# Altium schematic sheet Nixies.SchDoc
size B; SheetNumber: 4; SheetTotal: 5
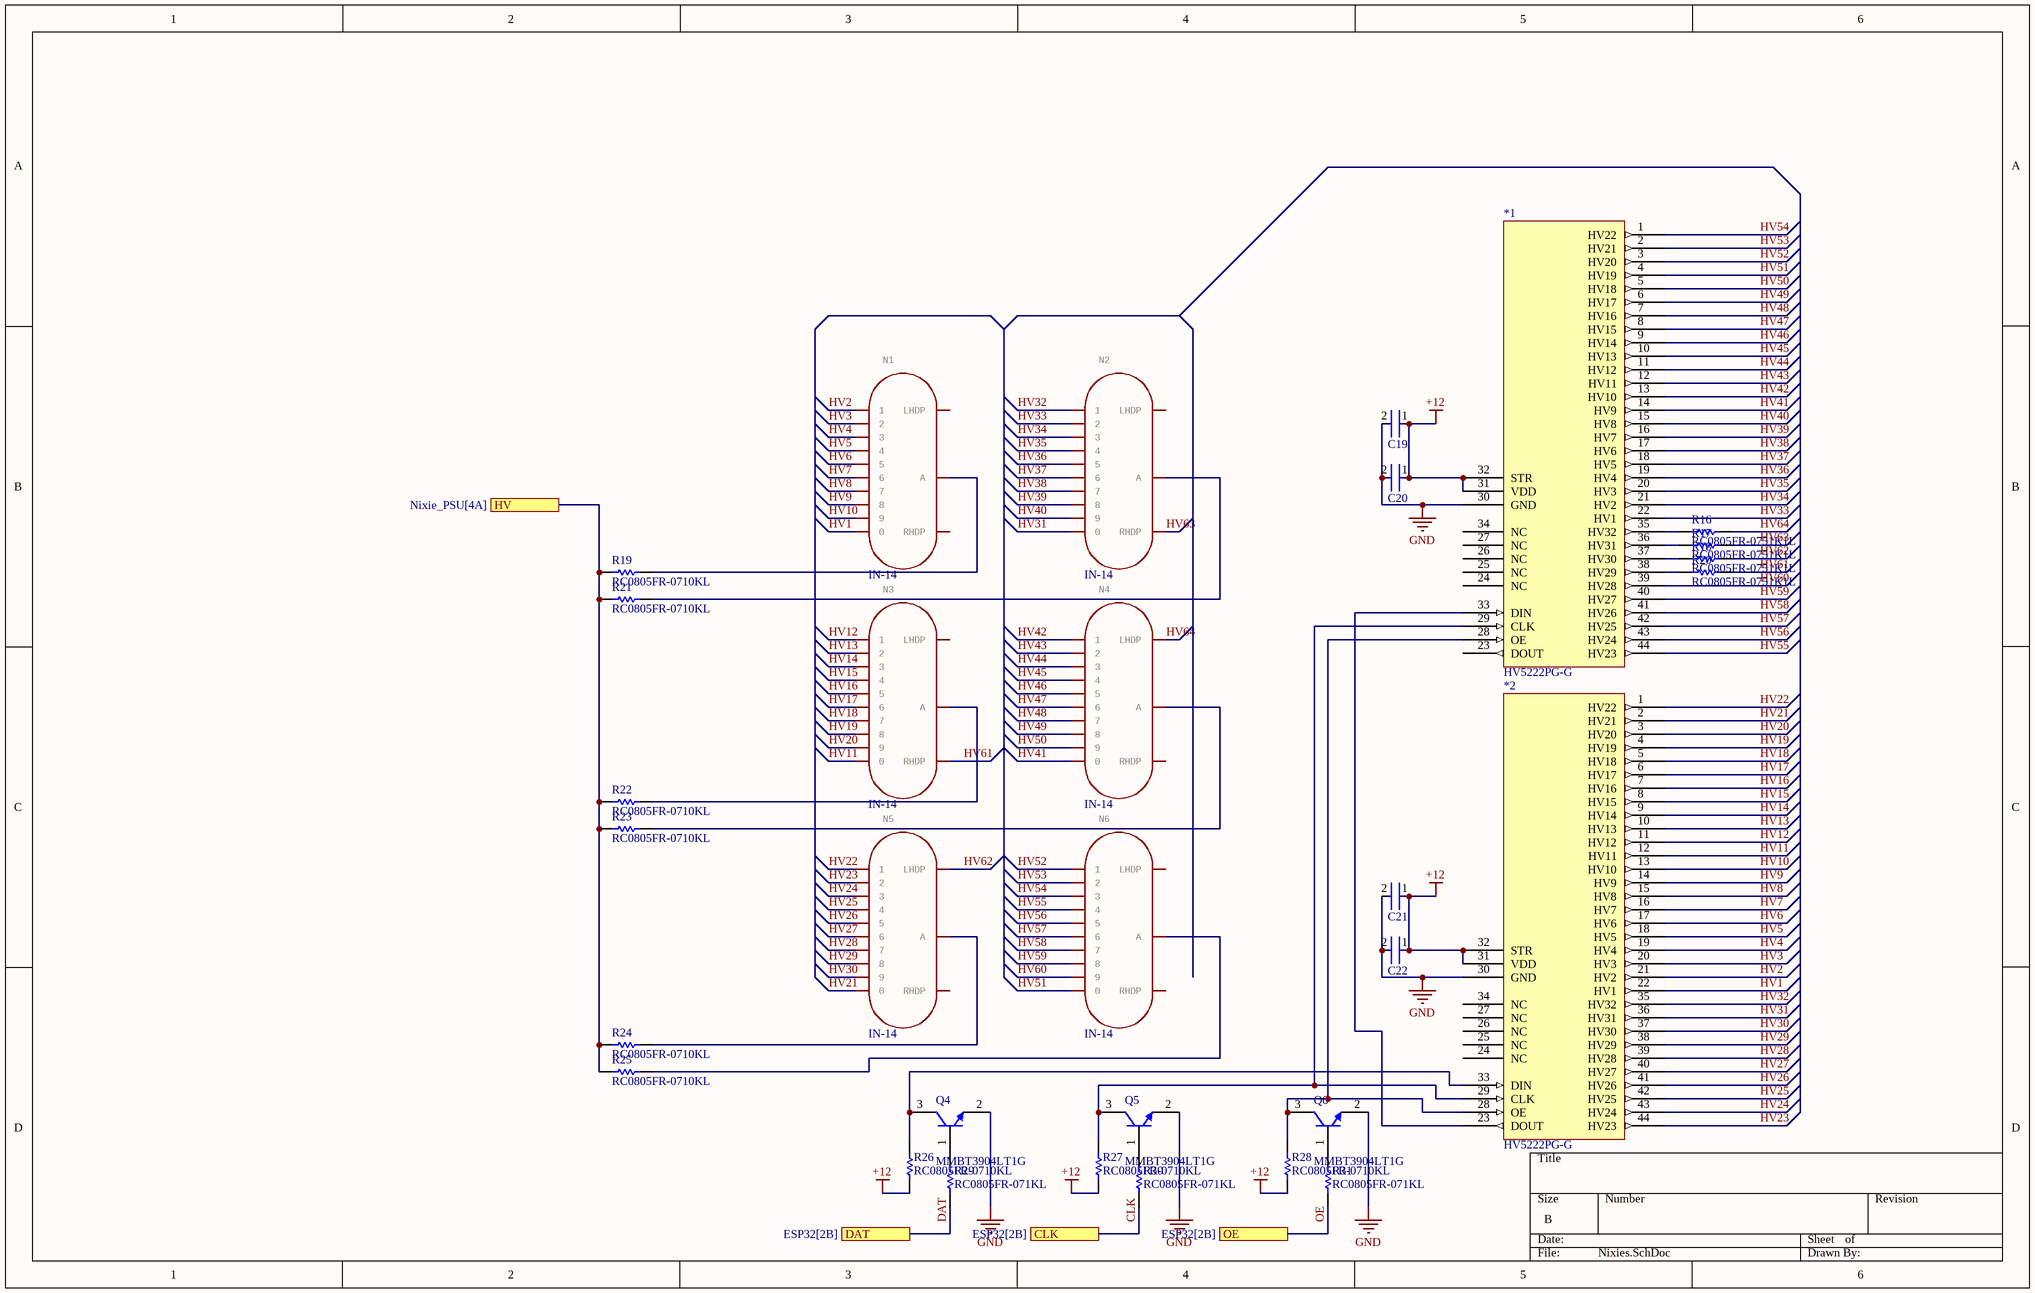
[diagram p0: Nixies.SchDoc]

## Parts
*1  HV5222PG-G  [QFP80P1390X1390X235-44N]
*2  HV5222PG-G  [QFP80P1390X1390X235-44N]
C19  GRM188R60J476ME15D  [FP-GRM188-0_2-IPC_B]  (value not drawn)
C20  GRM188R60J476ME15D  [FP-GRM188-0_2-IPC_B]  (value not drawn)
C21  GRM188R60J476ME15D  [FP-GRM188-0_2-IPC_B]  (value not drawn)
C22  GRM188R60J476ME15D  [FP-GRM188-0_2-IPC_B]  (value not drawn)
N1  IN-14  [IN-14]
N2  IN-14  [IN-14]
N3  IN-14  [IN-14]
N4  IN-14  [IN-14]
N5  IN-14  [IN-14]
N6  IN-14  [IN-14]
Q4  MMBT3904LT1G  [ONSC-SOT-23-3-318-08_V]
Q5  MMBT3904LT1G  [ONSC-SOT-23-3-318-08_V]
Q6  MMBT3904LT1G  [ONSC-SOT-23-3-318-08_V]
R16  RC0805FR-0751K1L  [RESC2013X60X35LL10T20]
R17  RC0805FR-0751K1L  [RESC2013X60X35LL10T20]
R18  RC0805FR-0751K1L  [RESC2013X60X35LL10T20]
R19  RC0805FR-0710KL  [RESC2013X60X35NL10T20]
R20  RC0805FR-0751K1L  [RESC2013X60X35LL10T20]
R21  RC0805FR-0710KL  [RESC2013X60X35NL10T20]
R22  RC0805FR-0710KL  [RESC2013X60X35NL10T20]
R23  RC0805FR-0710KL  [RESC2013X60X35NL10T20]
R24  RC0805FR-0710KL  [RESC2013X60X35NL10T20]
R25  RC0805FR-0710KL  [RESC2013X60X35NL10T20]
R26  RC0805FR-0710KL  [RESC2013X60X35NL10T20]
R27  RC0805FR-0710KL  [RESC2013X60X35NL10T20]
R28  RC0805FR-0710KL  [RESC2013X60X35NL10T20]
R29  RC0805FR-071KL  [RESC2013X60X35ML10T20]
R30  RC0805FR-071KL  [RESC2013X60X35ML10T20]
R31  RC0805FR-071KL  [RESC2013X60X35ML10T20]

## Ports
CLK (see ESP32[2B]), DAT (see ESP32[2B]), HV (see Nixie_PSU[4A]), OE (see ESP32[2B])

## Nets
+12: *1.31(VDD) *1.32(STR) *2.31(VDD) *2.32(STR) C19.1 C20.1 C21.1 C22.1 R26.1 R27.1 R28.1
GND: *1.30(GND) *2.30(GND) C19.2 C20.2 C21.2 C22.2 Q4.2(E) Q5.2(E) Q6.2(E)
CLK: R30.1 ; port CLK
DAT: R29.1 ; port DAT
HV: R19.2 R21.2 R22.2 R23.2 R24.2 R25.2 ; port HV
HV1: *2.22(HV1) N1.0
HV2: *2.21(HV2) N1.1
HV3: *2.20(HV3) N1.2
HV4: *2.19(HV4) N1.3
HV5: *2.18(HV5) N1.4
HV6: *2.17(HV6) N1.5
HV7: *2.16(HV7) N1.6
HV8: *2.15(HV8) N1.7
HV9: *2.14(HV9) N1.8
HV10: *2.13(HV10) N1.9
HV11: *2.12(HV11) N3.0
HV12: *2.11(HV12) N3.1
HV13: *2.10(HV13) N3.2
HV14: *2.9(HV14) N3.3
HV15: *2.8(HV15) N3.4
HV16: *2.7(HV16) N3.5
HV17: *2.6(HV17) N3.6
HV18: *2.5(HV18) N3.7
HV19: *2.4(HV19) N3.8
HV20: *2.3(HV20) N3.9
HV21: *2.2(HV21) N5.0
HV22: *2.1(HV22) N5.1
HV23: *2.44(HV23) N5.2
HV24: *2.43(HV24) N5.3
HV25: *2.42(HV25) N5.4
HV26: *2.41(HV26) N5.5
HV27: *2.40(HV27) N5.6
HV28: *2.39(HV28) N5.7
HV29: *2.38(HV29) N5.8
HV30: *2.37(HV30) N5.9
HV31: *2.36(HV31) N2.0
HV32: *2.35(HV32) N2.1
HV33: *1.22(HV1) N2.2
HV34: *1.21(HV2) N2.3
HV35: *1.20(HV3) N2.4
HV36: *1.19(HV4) N2.5
HV37: *1.18(HV5) N2.6
HV38: *1.17(HV6) N2.7
HV39: *1.16(HV7) N2.8
HV40: *1.15(HV8) N2.9
HV41: *1.14(HV9) N4.0
HV42: *1.13(HV10) N4.1
HV43: *1.12(HV11) N4.2
HV44: *1.11(HV12) N4.3
HV45: *1.10(HV13) N4.4
HV46: *1.9(HV14) N4.5
HV47: *1.8(HV15) N4.6
HV48: *1.7(HV16) N4.7
HV49: *1.6(HV17) N4.8
HV50: *1.5(HV18) N4.9
HV51: *1.4(HV19) N6.0
HV52: *1.3(HV20) N6.1
HV53: *1.2(HV21) N6.2
HV54: *1.1(HV22) N6.3
HV55: *1.44(HV23) N6.4
HV56: *1.43(HV24) N6.5
HV57: *1.42(HV25) N6.6
HV58: *1.41(HV26) N6.7
HV59: *1.40(HV27) N6.8
HV60: *1.39(HV28) N6.9
HV61: N3.RHDP R20.2
HV62: N5.LHDP R18.2
HV63: N2.RHDP R17.2
HV64: N4.LHDP R16.2
OE: R31.1 ; port OE
Net*1_28: *1.28(OE) *2.28(OE) Q6.3(C) R28.2
Net*1_29: *1.29(CLK) *2.29(CLK) Q5.3(C) R27.2
Net*1_33: *1.33(DIN) *2.23(DOUT)
Net*1_35: *1.35(HV32) R16.1
Net*1_36: *1.36(HV31) R17.1
Net*1_37: *1.37(HV30) R18.1
Net*1_38: *1.38(HV29) R20.1
Net*2_33: *2.33(DIN) Q4.3(C) R26.2
NetN1_A: N1.A R19.1
NetN2_A: N2.A R21.1
NetN3_A: N3.A R22.1
NetN4_A: N4.A R23.1
NetN5_A: N5.A R24.1
NetN6_A: N6.A R25.1
NetQ4_1: Q4.1(B) R29.2
NetQ5_1: Q5.1(B) R30.2
NetQ6_1: Q6.1(B) R31.2

Not connected (* = marked no-connect by the designer): *1 23(DOUT) 24(NC) 25(NC) 26(NC) 27(NC) 34(NC); *2 24(NC) 25(NC) 26(NC) 27(NC) 34(NC); N1 LHDP RHDP; N2 LHDP; N3 LHDP; N4 RHDP; N5 RHDP; N6 LHDP RHDP

## Library data of the parts
*1 *2 = CMP-00024-00006-1: EL Driver, 32-Segment, PQFP44
C19-C22 = CMP-2000-05444-2: Chip Multilayer Ceramic Capacitors for General Purpose, 0603, 47uF, X5R, 15%, 20%, 6.3V; Voltage Rating (DC): 6.3V; Thickness: 0.039inch; Case Code (Imperial): 0603; Packaging: Tape and Reel; Capacitance: 47uF; Width: 0.031inch; Dielectric: X5R; Max Operating Temperature: 85°C; Mount: Surface Mount; Case Code (Metric): 1608; Length: 0.063inch; Voltage Rating: 6.3V; Tolerance: 20%; Case/Package: 0603; Min Operating Temperature: -55°C
N1-N6 = CMP-087-000009-1: GateName_1: G$1; Design Item ID: IN-14; SymbolName_1: IN-14; LibraryName: nixies-us; DeviceSetName: IN-14; Package: IN-14; Source: nixies-us.SCHLIB
Q4-Q6 = CMP-1048-00631-1: General Purpose Transistor, NPN Silicon, 3-Pin SOT-23, Pb-Free, Tape and Reel; Manufacturer: On Semiconductor; IC Continuous (A): 0.2; fT Min (MHz): 300; ComponentLink2Description: Datasheet; Polarity: NPN; PackageDescription: 3-Pin Small Outline Transistor, Body 2.92 x 1.3 mm, Pitch 0.95 mm; ComponentLink2URL: http://www.onsemi.cn/pub_link/Collateral/MMBT3904LT1-D.PDF; DatasheetVersion: Rev. 12; Mounting Technology: Surface Mount; PartNumber: MMBT3904LT1G; ComponentLink1URL: http://www.onsemi.com/; ComponentLink3Description: Package Specification; ComponentLink1Description: Manufacturer URL; PackageVersion: Rev. AP, 11/2009; PackageReference: SOT-23-3-318-08; Packing: Tape and Reel; ComponentLink3URL: http://www.onsemi.cn/pub_link/Collateral/318-08.PDF; RoHS: TRUE
R16-R18 R20 = CMP-2001-01183-1: Manufacturer: Yageo; Part Number: RC0805FR-0751K1L
R19 R21-R28 = CMP-1659-00013-4: Chip Resistor, 10 KOhm, +/- 1%, 0.125 W, -55 to 155 degC, 0805 (2012 Metric), RoHS, Tape and Reel; Manufacturer: Yageo; Voltage Rating: 150 V; Mount: Surface Mount; ComponentLink1Description: Manufacturer URL; ComponentLink2URL: http://www.yageo.com/documents/recent/PYu-RC_Group_51_RoHS_L_04.pdf; Pins: 2; Length: 2 mm; Min Operating Temperature: -55 degC; Height: 0.5 mm; Mounting Technology: Surface Mount; RoHSCompliant: true; REACH SVHC: No SVHC; ComponentLink1URL: http://www.yageo.com/; Max Operating Temperature: 155 degC; PackageReference: 0805; DatasheetVersion: Rev. 4, 02/2016; Package Quantity: 5000; Packaging: Tape and Reel; ComponentLink2Description: Datasheet; PackageDescription: 2-Pin Surface Mounted Device, Body 2 x 1.25 mm
R29-R31 = CMP-2100-03671-1: Chip Resistor, 1 KOhm, +/- 1%, 125 mW, -55 to 155 degC, 0805 (2012 Metric), RoHS, Tape and Reel; Manufacturer: Yageo; Temperature Coefficient: 100ppm/degreesC; Voltage Rating (DC): 150V; Max Power Dissipation: 125mW; Resistance: 1KOhm; Number of Pins: 2; Number of Terminations: 2; Datasheet URL: http://www.yageo.com/NewPortal/yageodocoutput?fileName=/pdf/R-Chip/PYu-RC_Group_51_RoHS_L_5.pdf; Length: 0.079inch; Package Description: 2-Pin Surface Mounted Device, Body 2 x 1.25 mm; Depth: 1.25mm; Height: 0.024inch; Military Standard: Not; Case/Package: 0805; Package Reference: 0805; RoHSCompliant: true; Lead Free: LeadFree; Packaging: TapeandReel; Package Quantity: 1; Datasheet Version: Rev. 5, 10/2016; Tolerance: 1%; Min Operating Temperature: -55degC; Voltage Rating: 150V; Composition: ThickFilm; Case Code (Imperial): 0805; Power Rating: 125mW; Width: 0.049inch; Case Code (Metric): 2012; Manufacturer URL: http://www.yageo.com/; Max Operating Temperature: 155degC; REACH SVHC: Unknown; Termination: SMD/SMT